# EAGLE design CiroSeriale V1 (EAGLE 9.5.1)
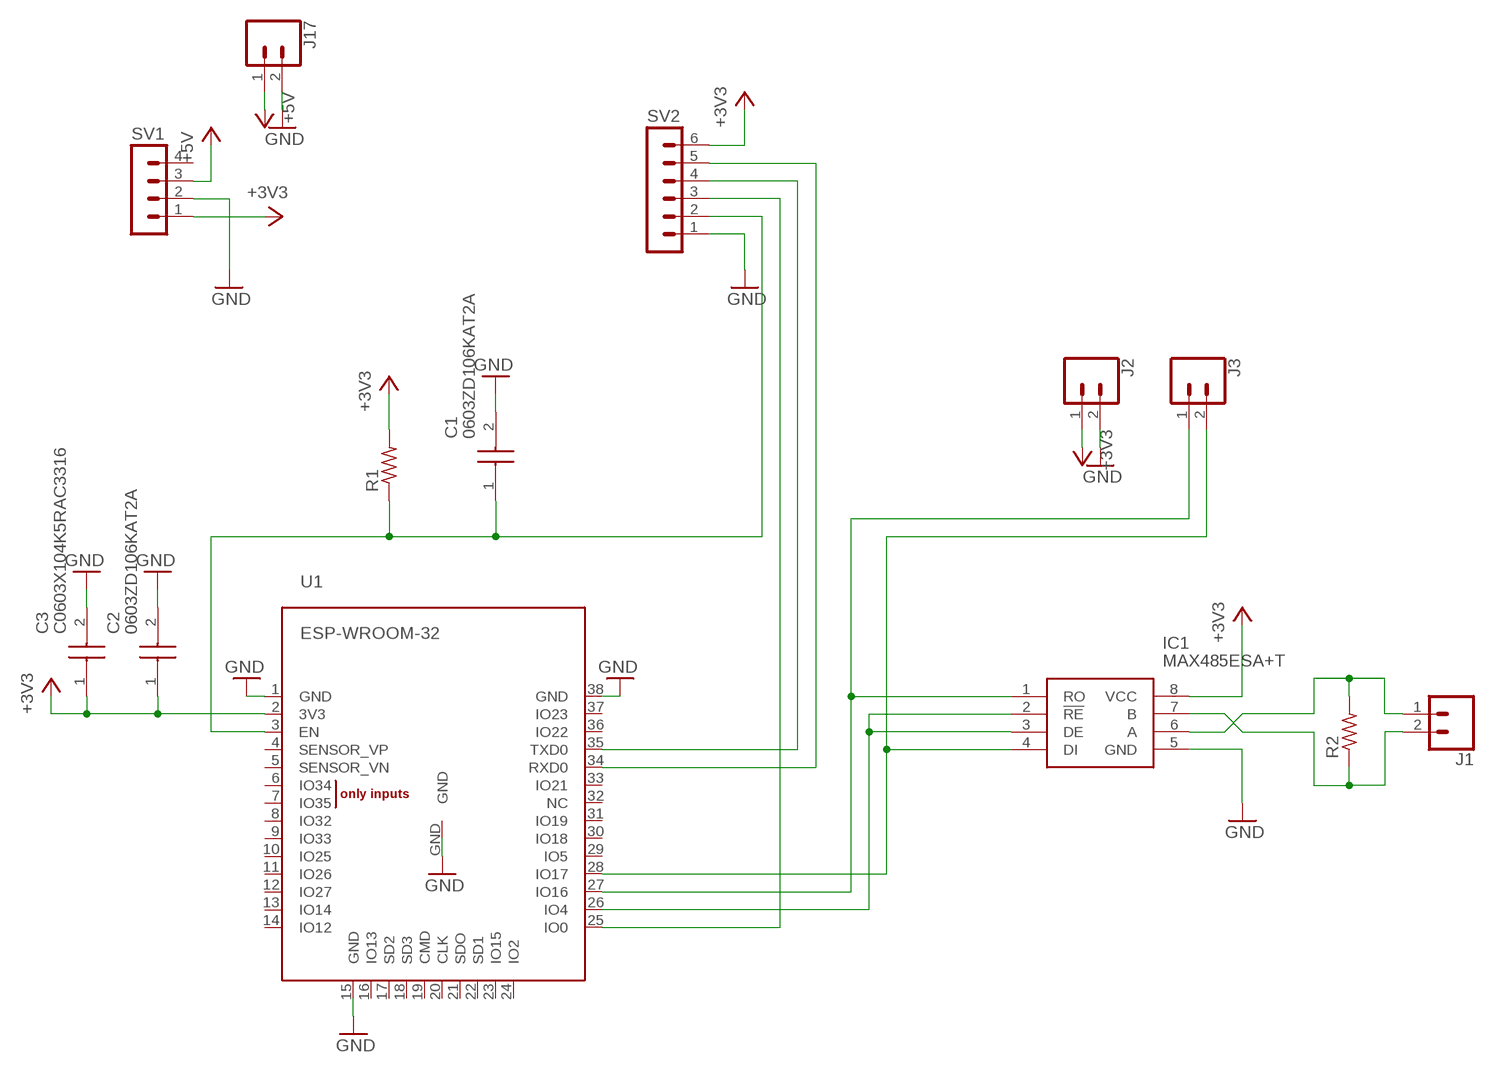
[diagram p0: schematic, sheet 1]

## Parts
C1  0603ZD106KAT2A  [CAPC1608X90N]
C2  0603ZD106KAT2A  [CAPC1608X90N]
C3  C0603X104K5RAC3316  [CAPC1608X95N]
IC1  MAX485ESA+T  [SOIC127P600X175-8N]
J1  CONN_025MM  [SCREWTERMINAL-5MM-2]
J2  CONN_025MM  [SCREWTERMINAL-5MM-2]
J3  CONN_025MM  [SCREWTERMINAL-5MM-2]
J17  CONN_025MM  [SCREWTERMINAL-5MM-2]
R1  R-US_R0603  [R0603]
R2  R-US_0204/7  [0204/7]
SV1  MA04-1  [MA04-1]
SV2  MA06-1  [MA06-1]
U1  ESP-WROOM-32  [ESP-WROOM-32]

## Nets
+3V3: C2.1 C3.1 IC1.8(VCC) J2.1 R1.2 SV1.1 SV2.6 U1.2(3V3)
+5V: J17.1 SV1.3
GND: C1.2 C2.2 C3.2 IC1.5(GND) J2.2 J17.2 SV1.2 SV2.1 U1.1(GND) U1.15(GND) U1.38(GND) U1.GND
N$1: IC1.4(DI) J3.2 U1.28(IO17)
N$2: IC1.1(RO) J3.1 U1.27(IO16)
N$3: IC1.6(A) J1.1 R2.2
N$4: IC1.7(B) J1.2 R2.1
N$5: SV2.4 U1.35(TXD0)
N$6: SV2.5 U1.34(RXD0)
N$7: SV2.3 U1.25(IO0)
N$8: C1.1 R1.1 SV2.2 U1.3(EN)
N$10: IC1.2(!RE) IC1.3(DE) U1.26(IO4)
Unconnected: SV1.4 U1.4(SENSOR_VP) U1.5(SENSOR_VN) U1.6(IO34) U1.7(IO35) U1.8(IO32) U1.9(IO33) U1.10(IO25) U1.11(IO26) U1.12(IO27) U1.13(IO14) U1.14(IO12) U1.16(IO13) U1.17(SD2) U1.18(SD3) U1.19(CMD) U1.20(CLK) U1.21(SDO) U1.22(SD1) U1.23(IO15) U1.24(IO2) U1.29(IO5) U1.30(IO18) U1.31(IO19) U1.32(NC) U1.33(IO21) U1.36(IO22) U1.37(IO23)

## Library data of the parts
C1 C2 = SamacSys_Parts:0603ZD106KAT2A: Multilayer Ceramic Capacitors MLCC - SMD/SMT 10V 10uF X5R 0603 10%TOL Source: Datasheet <https://componentsearchengine.com/Datasheets/1/0603ZD106KAT2A.pdf>; DESCRIPTION: Multilayer Ceramic Capacitors MLCC - SMD/SMT 10V 10uF X5R 0603 10%TOL; HEIGHT: 0.9mm; MANUFACTURER_NAME: AVX; MANUFACTURER_PART_NUMBER: 0603ZD106KAT2A; MOUSER_PART_NUMBER: 581-0603ZD106KAT2A; MOUSER_PRICE-STOCK: https://www.mouser.com/Search/Refine.aspx?Keyword=581-0603ZD106KAT2A
C3 = SamacSys_Parts:C0603X104K5RAC3316: Multilayer Ceramic Capacitors MLCC - SMD/SMT 50V .1uF X7R AUTO 5mm Flex VW80808 Source: Datasheet <https://componentsearchengine.com/Datasheets/1/C0603X104K5RAC3316.pdf>; DESCRIPTION: Multilayer Ceramic Capacitors MLCC - SMD/SMT 50V .1uF X7R AUTO 5mm Flex VW80808; HEIGHT: 0.95mm; MANUFACTURER_NAME: Kemet; MANUFACTURER_PART_NUMBER: C0603X104K5RAC3316; MOUSER_PART_NUMBER: 80-C0603X104K5R3316; MOUSER_PRICE-STOCK: https://www.mouser.com/Search/Refine.aspx?Keyword=80-C0603X104K5R3316
IC1 = SamacSys_Parts:MAX485ESA+T: RS-422/RS-485 Interface IC Low-Power, Slew-Rate-Limited RS-485/RS-422 Transceivers Source: Datasheet <https://componentsearchengine.com/Datasheets/1/MAX485ESA T.pdf>; DESCRIPTION: RS-422/RS-485 Interface IC Low-Power, Slew-Rate-Limited RS-485/RS-422 Transceivers; HEIGHT: 1.75mm; MANUFACTURER_NAME: Maxim Integrated; MANUFACTURER_PART_NUMBER: MAX485ESA+T; MOUSER_PART_NUMBER: 700-MAX485ESAT; MOUSER_PRICE-STOCK: https://www.mouser.com/Search/Refine.aspx?Keyword=700-MAX485ESAT
J1-J3 J17 = SparkFun-Connectors:CONN_02: Multi connection point. Often used as Generic Header-pin footprint for 0.1 inch spaced/style header connections On any of the 0.1 inch spaced packages, you can populate with these: Break Away Headers - Straight <https://www.sparkfun.com/products/116> (PRT-00116) Break Away Male Headers - Right Angle <https://www.sparkfun.com/products/553> (PRT-00553) Female Headers <https://www.sparkfun.com/products/115> (PRT-00115) Break Away Headers - Machine Pin <https://www.sparkfun.com/products/117> (PRT-00117) Break Away Female Headers - Swiss Machine Pin <https://www.sparkfun.com/products/743> (PRT-00743) For SCREWTERMINALS and SPRING TERMINALS visit here: Screw Terimnals on SparkFun.com <https://www.sparkfun.com/search/results?term=Screw+Terminals> (5mm/3.5mm/2.54mm spacing) This device is also useful as a general connection point to wire up your design to another part of your project. Our various solder wires solder well into these plated through hole pads. Hook-Up Wire - Assortment (Stranded, 22 AWG) <https://www.sparkfun.com/products/11375> (PRT-11375) Hook-Up Wire - Assortment (Solid Core, 22 AWG) <https://www.sparkfun.com/products/11367> (PRT-11367) View the entire wire category on our website here <https://www.sparkfun.com/categories/141> Special notes: Molex polarized connector foot print use with: PRT-08233 with associated crimp pins and housings. 2.54_SCREWTERM for use with PRT-10571. 3.5mm Screw Terminal footprints for PRT-08084 5mm Screw Terminal footprints for use with PRT-08432; SF_SKU: PRT-08432
R1 = resistor:R-US_: RESISTOR, American symbol
R2 = rcl:R-US_: RESISTOR, American symbol; SPICEPREFIX: R
SV1 = con-lstb:MA04-1: PIN HEADER; OC_FARNELL: unknown; OC_NEWARK: unknown
SV2 = con-lstb:MA06-1: PIN HEADER; OC_FARNELL: unknown; OC_NEWARK: unknown
U1 = esp32:ESP-WROOM-32

## Board
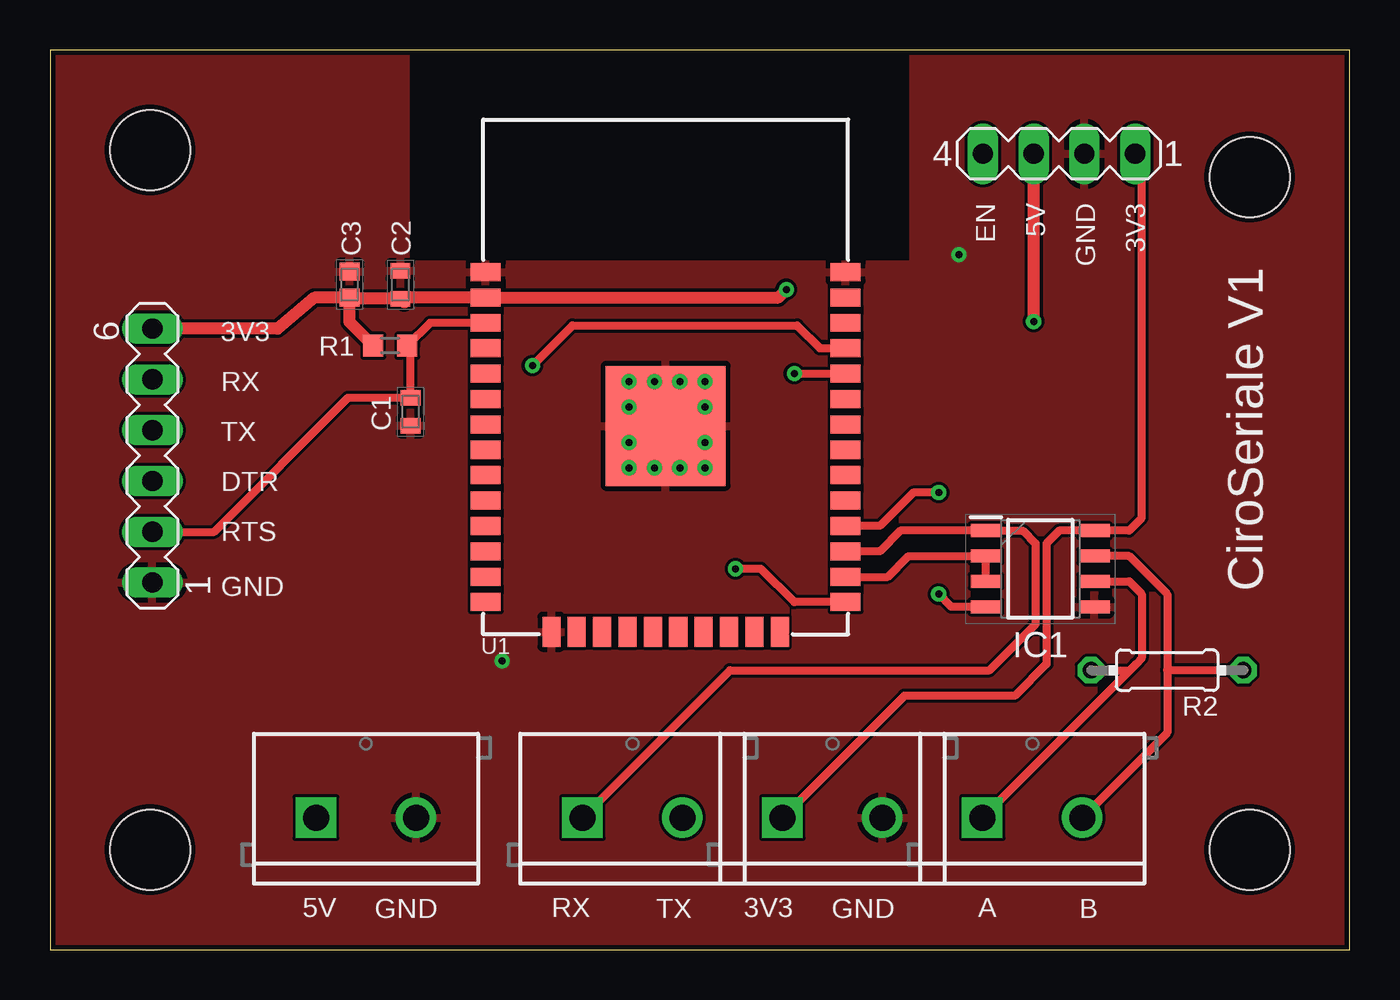
[diagram p1: board, top side]
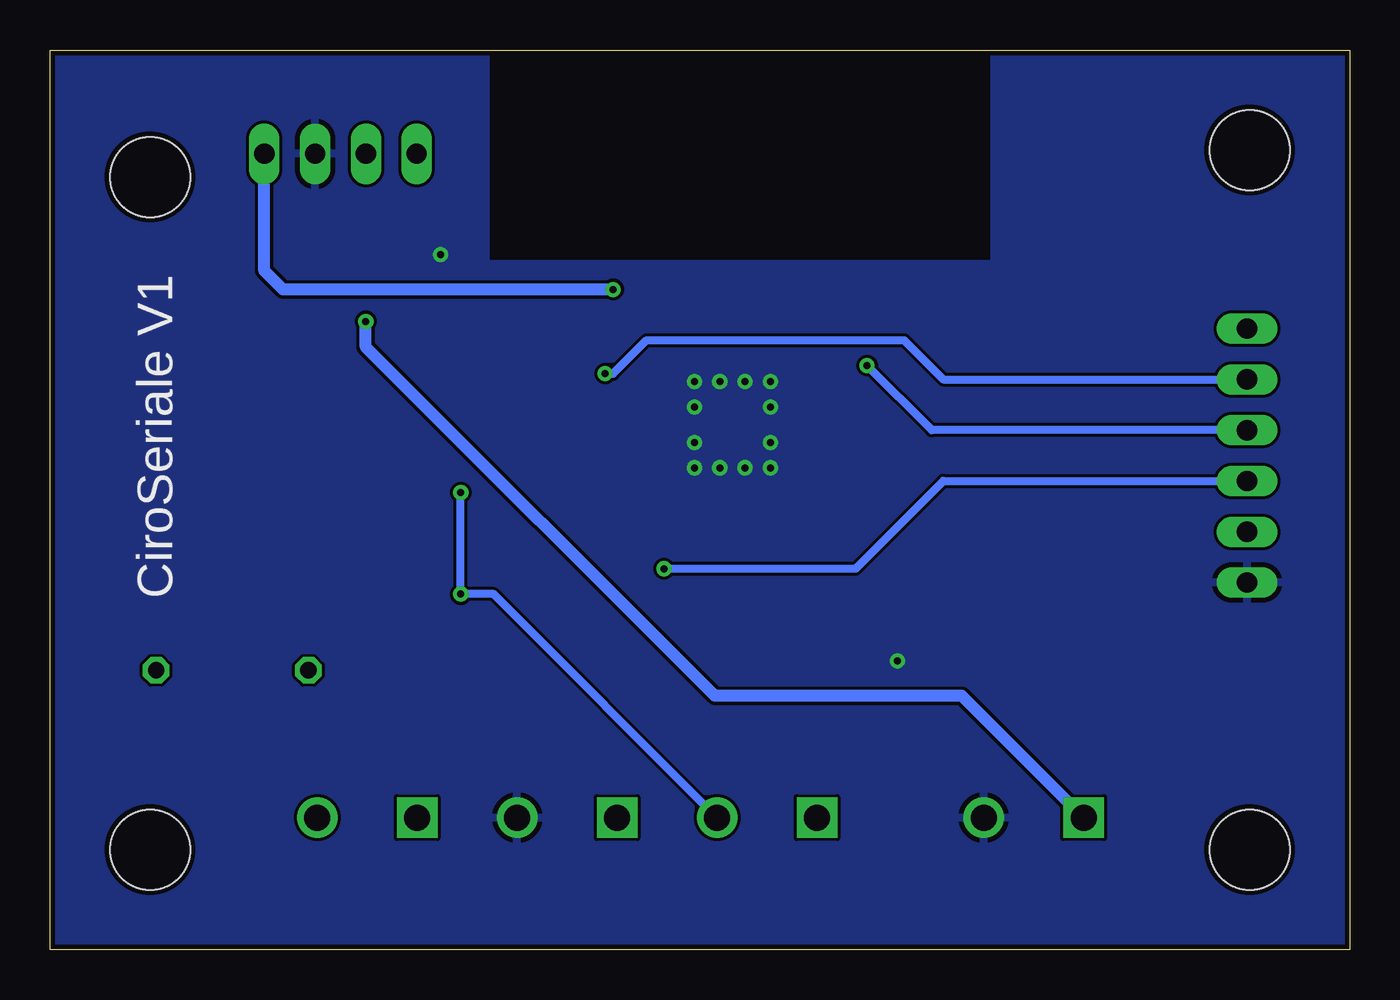
[diagram p2: board, bottom side, seen from below]

Size 65 x 45 mm. Coordinates in mm from the lower left corner, seen from the top.
Outline: 0,0 65,0 65,45 0,45 0,0
Copper layers (1*16): Top 0.035mm / dielectric 1.5mm / Bottom 0.035mm
Design rules "default *": minimum track width 6mil, minimum drill 0.35mm, track to track 6mil, track to pad 6mil, pad to pad 6mil, via to via 6mil, smd to smd 6mil, copper to edge 10mil, drill to drill 6mil, minimum pad ring 10mil, minimum via ring 8mil, stop-mask expansion 4mil, vias tented up to drill 0mil, thermal gap 10mil
Holes 4 mm at 60,38.65 5,40 5,5 60,5

### Footprints (pad centres in the part's own frame; a part is rotated, then mirrored left to right if it is on the bottom)
CAPC1608X90N = smd 0.78 x 0.99: 1 -0.7,0; 2 0.7,0
CAPC1608X95N = smd 0.89 x 0.98: 1 -0.65,0; 2 0.65,0
SOIC127P600X175-8N = smd 1.525 x 0.65: 1 -2.712,1.905; 2 -2.712,0.635; 3 -2.712,-0.635; 4 -2.712,-1.905; 5 2.712,-1.905; 6 2.712,-0.635; 7 2.712,0.635; 8 2.712,1.905
SCREWTERMINAL-5MM-2 = drill 1.3 pad 2.032 square: 1 0,0 | drill 1.3 pad 2.032: 2 5,0
R0603 = smd 1 x 1.1: 1 -0.85,0; 2 0.85,0
0204/7 = drill 0.813 octagon: 1 -3.81,0; 2 3.81,0
MA04-1 = drill 1.016 long: 1 -3.81,0; 2 -1.27,0; 3 1.27,0; 4 3.81,0
MA06-1 = drill 1.016 long: 1 -6.35,0; 2 -3.81,0; 3 -1.27,0; 4 1.27,0; 5 3.81,0; 6 6.35,0
ESP-WROOM-32 = smd 0.9 x 1.5: 1 7.7,9; 2 6.43,9; 3 5.16,9; 4 3.89,9; 5 2.62,9; 6 1.35,9; 7 0.08,9; 8 -1.19,9; 9 -2.46,9; 10 -3.73,9; 11 -5,9; 12 -6.27,9; 13 -7.54,9; 14 -8.81,9; 25 -8.81,-9; 26 -7.54,-9; 27 -6.27,-9; 28 -5,-9; 29 -3.73,-9; 30 -2.46,-9; 31 -1.19,-9; 32 0.08,-9; 33 1.35,-9; 34 2.62,-9; 35 3.89,-9; 36 5.16,-9; 37 6.43,-9; 38 7.7,-9 | smd 1.5 x 0.9: 15 -10.3,5.715; 16 -10.3,4.445; 17 -10.3,3.175; 18 -10.3,1.905; 19 -10.3,0.635; 20 -10.3,-0.635; 21 -10.3,-1.905; 22 -10.3,-3.175; 23 -10.3,-4.445; 24 -10.3,-5.715 | smd 6 x 6: GND 0,0

### Placement (x,y rotation side)
C1  18.03,26.91 270 top
C2  17.53,33.26 90 top
C3  14.99,33.26 90 top
IC1  49.53,19.05 0 top
J1  46.63,6.6 0 top
J2  36.63,6.6 0 top
J3  26.63,6.6 0 top
J17  13.3,6.6 0 top
R1  17.02,30.21 180 top
R2  55.88,13.97 180 top
SV1  50.47,39.81 180 top
SV2  5.12,24.71 90 top
U1  30.79,26.19 90 top

### Tracks (layer width: path | path; a pad name or v marks a point on that pad's centre or on a via)
+3V3  (via drill 0.35)
  Top 0.406: SV1.1 54.61,39.48 54.61,21.59 53.98,20.95 IC1.8 50.48,20.95 49.85,20.32 49.85,14.29 48.26,12.7 42.73,12.7 J2.1
  Top 0.61: C3.1 15.04,32.56 C2.1 17.72,32.37 17.73,32.62 U1.2 36.43,32.62 v36.83,33.02 | R1.2 14.99,31.39 C3.1 | C3.1 13.22,32.61 11.38,31.06 SV2.6
  Bottom 0.61: v36.83,33.02 53.34,33.02 54.28,33.96 SV1.1
+5V  (via drill 0.35)
  Top 0.61: v49.2,31.42 SV1.3
  Bottom 0.61: v49.2,31.42 49.2,30.15 31.75,12.7 19.4,12.7 J17.1
GND  (via drill 0.35)
  other vias: 28.96,27.14 28.96,28.41 30.23,28.41 31.5,28.41 32.77,28.41 32.77,27.14 32.77,25.37 32.77,24.1 31.5,24.1 30.23,24.1 28.96,25.37 28.96,24.1 22.61,14.44 45.47,34.76
  pour Top: 0,0 0,45.72 17.78,45.72 17.78,34.29 43.18,34.29 43.18,45.72 64.77,45.72 64.77,0
  pour Bottom: 0,0 0,45.72 17.78,45.72 17.78,34.29 43.18,34.29 43.18,45.72 64.77,45.72 64.77,0
N$1  (via drill 0.35)
  Top 0.406: IC1.4 45.09,17.14 v44.45,17.78 | v44.45,22.86 43.18,22.86 41.51,21.19 U1.28
  Bottom 0.406: v44.45,22.86 v44.45,17.78 42.81,17.78 J3.2
N$2
  Top 0.406: U1.27 41.51,19.92 42.55,20.95 IC1.1 48.65,20.95 49.29,20.32 49.29,16.27 46.99,13.97 34,13.97 J3.1
N$3
  Top 0.406: IC1.6 53.98,18.41 54.61,17.78 54.61,14.58 54.3,14.28 54,13.97 | 54,13.97 J1.1 | R2.2 54,13.97
N$4
  Top 0.406: 55.88,13.97 55.88,17.78 53.98,19.68 IC1.7 | 55.88,13.97 55.88,10.85 J1.2 | R2.1 55.88,13.97
N$5  (via drill 0.35)
  Top 0.406: 40.23,30.19 U1.35 38.5,30.08 37.37,31.21 26.13,31.21 v24.13,29.21
  Bottom 0.406: SV2.4 20.9,25.98 v24.13,29.21
N$6  (via drill 0.35)
  Top 0.406: v37.23,28.81 U1.34
  Bottom 0.406: SV2.5 20.32,28.52 22.28,30.48 35.16,30.48 36.83,28.81 v37.23,28.81
N$7  (via drill 0.35)
  Top 0.406: v34.29,19.05 35.56,19.05 37.23,17.38 U1.25
  Bottom 0.406: SV2.3 20.32,23.44 24.71,19.05 v34.29,19.05
N$8
  Top 0.406: 18.15,30.35 18.14,29.94 R1.1 | R1.1 18.03,30.05 C1.1 14.91,27.61 8.2,20.9 SV2.2 | U1.3 19.01,31.35 R1.1
N$10
  Top 0.406: U1.26 41.91,18.65 42.95,19.68 IC1.2 IC1.3

### Text on the board
tNames: EN | 5V | GND | 3V3 | C3 | C2 | 3V3 | RX | C1 | TX | DTR | RTS | GND | CiroSeriale V1 | 5V | GND | RX | TX | 3V3 | GND | A | B
bNames: CiroSeriale V1